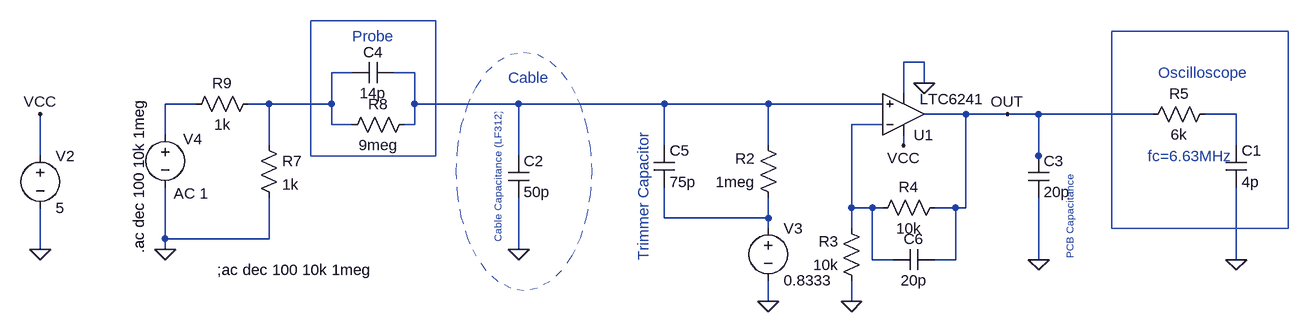
[diagram p0: schematic InputStage2_FreqDomain.asc]
InputStage2_FreqDomain.asc, the LTspice schematic file:
Version 4
SHEET 1 1004 680
WIRE 112 -320 80 -320
WIRE -768 -304 -800 -304
WIRE -672 -304 -704 -304
WIRE 112 -288 112 -320
WIRE 80 -272 80 -320
WIRE -1008 -256 -1056 -256
WIRE -896 -256 -928 -256
WIRE -800 -256 -800 -304
WIRE -800 -256 -896 -256
WIRE -672 -256 -672 -304
WIRE -512 -256 -672 -256
WIRE -288 -256 -512 -256
WIRE -128 -256 -288 -256
WIRE 48 -256 -128 -256
WIRE 176 -240 112 -240
WIRE 240 -240 176 -240
WIRE 288 -240 240 -240
WIRE 464 -240 288 -240
WIRE 592 -240 544 -240
WIRE -800 -224 -800 -256
WIRE -768 -224 -800 -224
WIRE -672 -224 -672 -256
WIRE -672 -224 -688 -224
WIRE 48 -224 0 -224
WIRE -1056 -208 -1056 -256
WIRE -896 -192 -896 -256
WIRE -288 -192 -288 -256
WIRE -128 -192 -128 -256
WIRE 80 -192 80 -208
WIRE 592 -192 592 -240
WIRE -1248 -176 -1248 -240
WIRE -512 -176 -512 -256
WIRE 288 -176 288 -240
WIRE 288 -160 288 -176
WIRE 0 -96 0 -224
WIRE 32 -96 0 -96
WIRE 48 -96 32 -96
WIRE 160 -96 128 -96
WIRE 176 -96 176 -240
WIRE 176 -96 160 -96
WIRE -288 -80 -288 -128
WIRE -128 -80 -128 -112
WIRE -128 -80 -288 -80
WIRE -128 -64 -128 -80
WIRE 0 -64 0 -96
WIRE -1056 -48 -1056 -128
WIRE -896 -48 -896 -112
WIRE -896 -48 -1056 -48
WIRE -1248 -32 -1248 -96
WIRE -1056 -32 -1056 -48
WIRE -512 -32 -512 -112
WIRE 32 -16 32 -96
WIRE 64 -16 32 -16
WIRE 160 -16 160 -96
WIRE 160 -16 128 -16
WIRE 288 -16 288 -112
WIRE 592 -16 592 -128
WIRE -128 48 -128 16
WIRE 0 48 0 16
FLAG 112 -288 0
FLAG -1248 -32 0
FLAG -1248 -240 VCC
FLAG 80 -192 VCC
FLAG 240 -240 OUT
FLAG 0 48 0
FLAG -128 48 0
FLAG -1056 -32 0
FLAG 592 -16 0
FLAG 288 -16 0
FLAG -512 -32 0
SYMBOL Opamps\\LTC6241 80 -240 M180
WINDOW 3 25 23 Left 2
SYMATTR InstName U1
SYMBOL voltage -1248 -192 R0
WINDOW 123 0 0 Left 2
WINDOW 39 0 0 Left 2
SYMATTR InstName V2
SYMATTR Value 5
SYMBOL res 144 -112 R90
WINDOW 0 0 56 VBottom 2
WINDOW 3 32 56 VTop 2
SYMATTR InstName R4
SYMATTR Value 10k
SYMBOL res 16 32 R180
WINDOW 0 36 76 Left 2
WINDOW 3 36 40 Left 2
SYMATTR InstName R3
SYMATTR Value 10k
SYMBOL res -112 -96 R180
WINDOW 0 36 76 Left 2
WINDOW 3 36 40 Left 2
SYMATTR InstName R2
SYMATTR Value 1meg
SYMBOL voltage -128 -80 R0
WINDOW 123 0 0 Left 2
WINDOW 39 0 0 Left 2
SYMATTR InstName V3
SYMATTR Value 0.8333
SYMBOL voltage -1056 -224 R0
WINDOW 0 28 22 Left 2
WINDOW 123 13 106 Left 2
WINDOW 39 0 0 Left 2
WINDOW 3 28 44 Left 2
SYMATTR InstName V4
SYMATTR Value2 AC 1
SYMATTR Value ""
SYMBOL cap 576 -192 R0
SYMATTR InstName C1
SYMATTR Value 4p
SYMBOL res 448 -224 R270
WINDOW 0 32 56 VTop 2
WINDOW 3 0 56 VBottom 2
SYMATTR InstName R5
SYMATTR Value 6k
SYMBOL cap -528 -176 R0
SYMATTR InstName C2
SYMATTR Value 50p
SYMBOL cap 272 -176 R0
SYMATTR InstName C3
SYMATTR Value 20p
SYMBOL res -912 -208 R0
SYMATTR InstName R7
SYMATTR Value 1k
SYMBOL res -784 -208 R270
WINDOW 0 32 56 VTop 2
WINDOW 3 0 56 VBottom 2
SYMATTR InstName R8
SYMATTR Value 9meg
SYMBOL cap -768 -288 R270
WINDOW 0 32 32 VTop 2
WINDOW 3 0 32 VBottom 2
SYMATTR InstName C4
SYMATTR Value 14p
SYMBOL res -1024 -240 R270
WINDOW 0 32 56 VTop 2
WINDOW 3 0 56 VBottom 2
SYMATTR InstName R9
SYMATTR Value 1k
SYMBOL cap -304 -192 R0
SYMATTR InstName C5
SYMATTR Value 75p
SYMBOL cap 128 -32 R90
WINDOW 0 0 32 VBottom 2
WINDOW 3 32 32 VTop 2
SYMATTR InstName C6
SYMATTR Value 20p
TEXT -1096 -264 VRight 2 !.ac dec 100 10k 1meg
TEXT 472 -304 Left 2 ;Oscilloscope
TEXT -544 -240 VRight 1 ;Cable Capacitance (LF312)
TEXT 336 -144 VRight 1 ;PCB Capacitance
TEXT 456 -176 Left 2 ;fc=6.63MHz
TEXT -768 -360 Left 2 ;Probe
TEXT -528 -296 Left 2 ;Cable
TEXT -320 -216 VRight 2 ;Trimmer Capacitor
TEXT -976 0 Left 2 !;ac dec 100 10k 1meg
RECTANGLE Normal 672 -64 400 -368
RECTANGLE Normal -640 -176 -832 -384
CIRCLE Normal -400 32 -608 -336 2

The netlist it stands for:
* InputStage2_FreqDomain.asc
XU1 N002 N005 VCC 0 OUT LTC6241  ; pins In+ In- V+ V- OUT
V2 VCC 0 5
R4 OUT N005 10k
R3 0 N005 10k
R2 N006 N002 1meg
V3 N006 0 0.8333
V4 N003 0 AC 1
C1 N004 0 4p
R5 OUT N004 6k
C2 N002 0 50p
C3 OUT 0 20p
R7 N001 0 1k
R8 N001 N002 9meg
C4 N001 N002 14p
R9 N003 N001 1k
C5 N002 N006 75p
C6 OUT N005 20p
.ac dec 100 10k 1meg
* Oscilloscope
* Cable Capacitance (LF312)
* PCB Capacitance
* fc=6.63MHz
* Probe
* Cable
* Trimmer Capacitor
;ac dec 100 10k 1meg
.lib LTC4.lib
.backanno
.end